# Altium project Archimajor.PrjPcb (part 1 of 3)
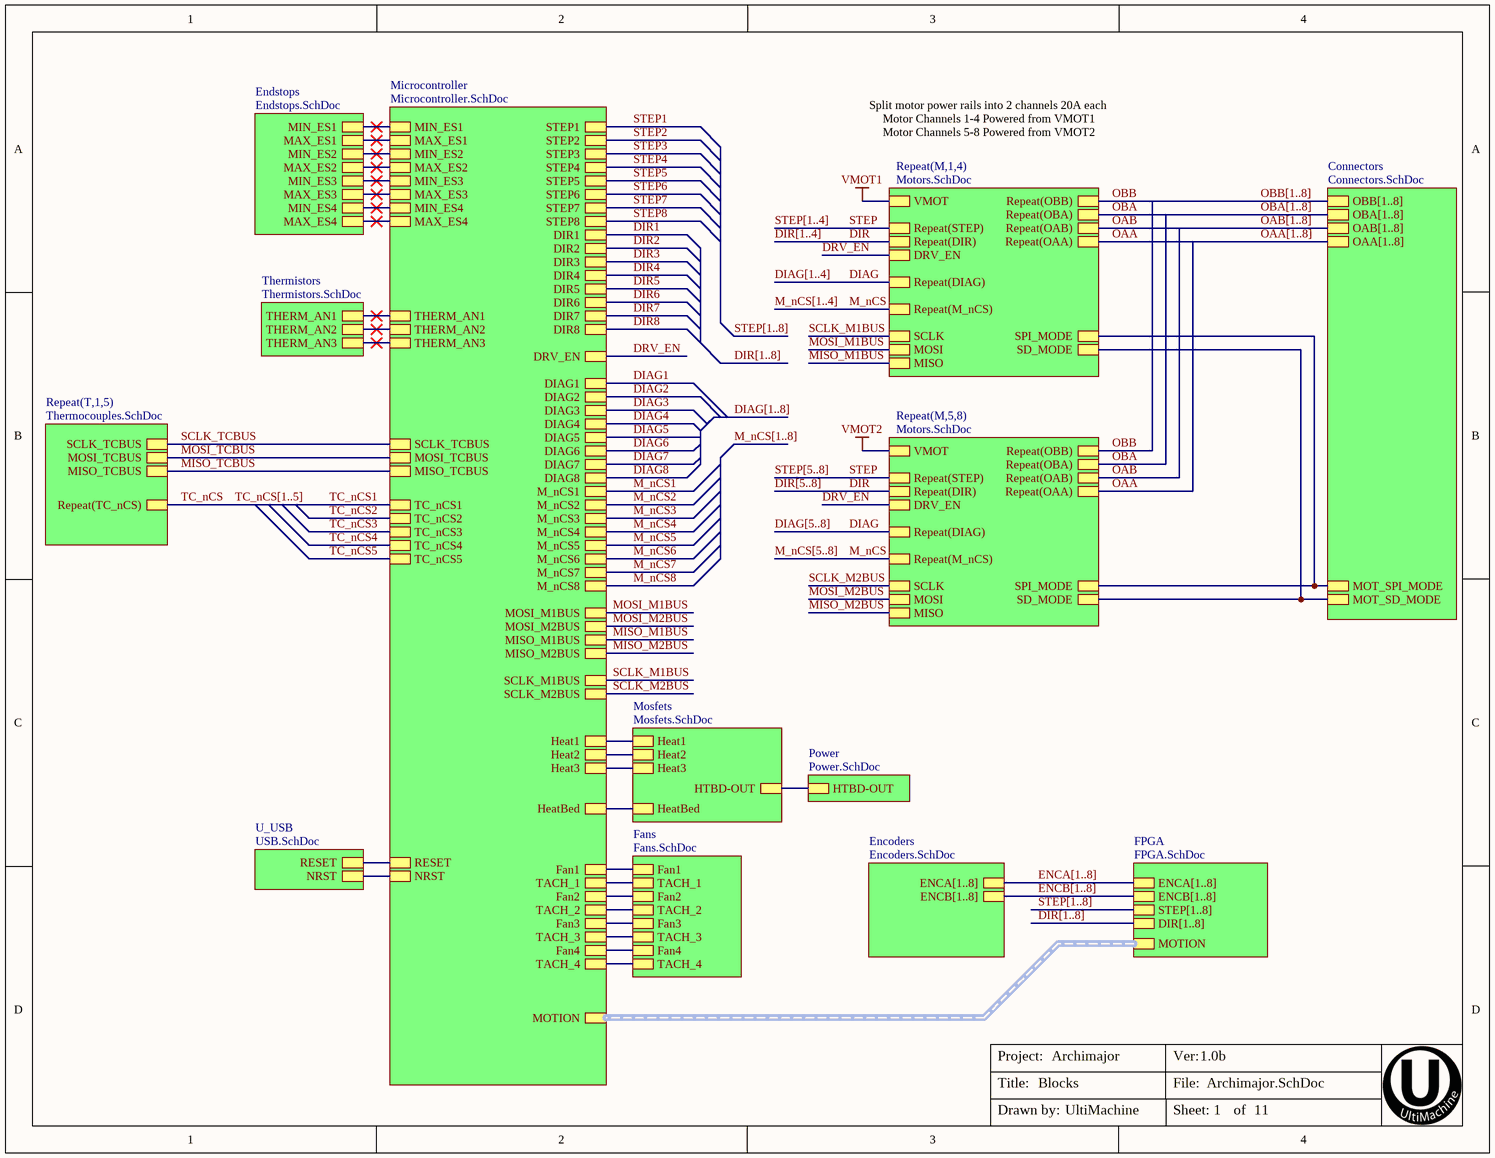
[diagram p0: Archimajor.SchDoc]
projectBoardVersion: 1.0b; projectDesigner: UltiMachine; projectdocumentNumber: .; projectDocumentRevision: b; projectTitle: Archimajor; projectVersion: 1.0b
9 sheets, 1081 parts. Net scope: hierarchical (ports join the sheet entries above them; power ports are global).
Board file: Archimajor.PcbDoc
Sheets:
  Archimajor.SchDoc
    M1 = Motors.SchDoc
    M2 = Motors.SchDoc
    M3 = Motors.SchDoc
    M4 = Motors.SchDoc
    Mosfets = Mosfets.SchDoc
    Power = Power.SchDoc
    Microcontroller = Microcontroller.SchDoc
    U_USB = USB.SchDoc
    M5 = Motors.SchDoc
    M6 = Motors.SchDoc
    M7 = Motors.SchDoc
    M8 = Motors.SchDoc
    T1 = Thermocouples.SchDoc
    T2 = Thermocouples.SchDoc
    T3 = Thermocouples.SchDoc
    T4 = Thermocouples.SchDoc
    T5 = Thermocouples.SchDoc
    Encoders = Encoders.SchDoc
    FPGA = FPGA.SchDoc

## Sheet Archimajor.SchDoc: Blocks
size Letter; DocumentNumber: 1; SheetNumber: 1; SheetTotal: 11

### Sub-sheets
Connectors = Connectors.SchDoc (file not in this document): MOT_SPI_MODE, MOT_SD_MODE, OBB[1..8], OBA[1..8], OAB[1..8], OAA[1..8]
Encoders = Encoders.SchDoc: ENCA[1..8], ENCB[1..8]
Endstops = Endstops.SchDoc (file not in this document): MAX_ES1, MIN_ES4, MAX_ES3, MAX_ES2, MIN_ES2, MIN_ES3, MIN_ES1, MAX_ES4
Fans = Fans.SchDoc (file not in this document): Fan3, TACH_3, TACH_2, Fan2, Fan4, Fan1, TACH_4, TACH_1
FPGA = FPGA.SchDoc: ENCA[1..8], ENCB[1..8], STEP[1..8], DIR[1..8], MOTION (harness MOTION)
Microcontroller = Microcontroller.SchDoc: TACH_4, THERM_AN1, THERM_AN2, THERM_AN3, TC_nCS1, MAX_ES1, MAX_ES3, MIN_ES2, MAX_ES2, MIN_ES1, MIN_ES3, HeatBed, Heat3, Heat2, Heat1, Fan2, Fan1, RESET, NRST, DRV_EN, TACH_3, TACH_1, TACH_2, TC_nCS2, DIAG1, DIR1, STEP1, M_nCS1, STEP2, M_nCS2, DIR2, DIR7, STEP3, M_nCS3, DIR3, STEP8, DIAG3, M_nCS4, STEP4, DIR4, DIAG4, M_nCS8, DIR5, STEP5, M_nCS5, DIAG5, DIR8, STEP7, DIAG6, STEP6, TC_nCS4, TC_nCS3, TC_nCS5, Fan3, Fan4, MIN_ES4, MAX_ES4, M_nCS6, DIAG7, M_nCS7, DIAG8, DIR6, MISO_M1BUS, MOSI_M1BUS, SCLK_TCBUS, SCLK_M1BUS, SCLK_M2BUS, MISO_TCBUS, MOSI_TCBUS, MOSI_M2BUS, MISO_M2BUS, DIAG2, MOTION (harness MOTION)
Mosfets = Mosfets.SchDoc: Heat2, Heat3, Heat1, HeatBed, HTBD-OUT
Power = Power.SchDoc: HTBD-OUT
Repeat(M,1,4) = Motors.SchDoc: Repeat(M_nCS), MOSI, MISO, SCLK, Repeat(STEP), Repeat(DIR), Repeat(DIAG), DRV_EN, SD_MODE, SPI_MODE, VMOT, Repeat(OBB), Repeat(OBA), Repeat(OAB), Repeat(OAA)
Repeat(M,5,8) = Motors.SchDoc: Repeat(M_nCS), MOSI, MISO, SCLK, Repeat(STEP), Repeat(DIR), Repeat(DIAG), DRV_EN, SD_MODE, SPI_MODE, VMOT, Repeat(OBB), Repeat(OBA), Repeat(OAB), Repeat(OAA)
Repeat(T,1,5) = Thermocouples.SchDoc: MISO_TCBUS, MOSI_TCBUS, SCLK_TCBUS, Repeat(TC_nCS)
Thermistors = Thermistors.SchDoc (file not in this document): THERM_AN3, THERM_AN1, THERM_AN2
U_USB = USB.SchDoc: NRST, RESET

### Nets
DIAG: sheet Repeat(M,1,4)/Repeat(DIAG), sheet Repeat(M,5,8)/Repeat(DIAG)
DIR: sheet Repeat(M,1,4)/Repeat(DIR), sheet Repeat(M,5,8)/Repeat(DIR)
DRV_EN: sheet Repeat(M,1,4)/DRV_EN, sheet Microcontroller/DRV_EN, sheet Repeat(M,5,8)/DRV_EN
Fan1: sheet Fans/Fan1, sheet Microcontroller/Fan1
Fan2: sheet Fans/Fan2, sheet Microcontroller/Fan2
Fan3: sheet Fans/Fan3, sheet Microcontroller/Fan3
Fan4: sheet Fans/Fan4, sheet Microcontroller/Fan4
Heat1: sheet Mosfets/Heat1, sheet Microcontroller/Heat1
Heat2: sheet Mosfets/Heat2, sheet Microcontroller/Heat2
Heat3: sheet Mosfets/Heat3, sheet Microcontroller/Heat3
HeatBed: sheet Mosfets/HeatBed, sheet Microcontroller/HeatBed
HTBD-OUT: sheet Mosfets/HTBD-OUT, sheet Power/HTBD-OUT
M_nCS: sheet Repeat(M,1,4)/Repeat(M_nCS), sheet Repeat(M,5,8)/Repeat(M_nCS)
MAX_ES1: sheet Endstops/MAX_ES1, sheet Microcontroller/MAX_ES1
MAX_ES2: sheet Endstops/MAX_ES2, sheet Microcontroller/MAX_ES2
MAX_ES3: sheet Endstops/MAX_ES3, sheet Microcontroller/MAX_ES3
MAX_ES4: sheet Endstops/MAX_ES4, sheet Microcontroller/MAX_ES4
MIN_ES1: sheet Endstops/MIN_ES1, sheet Microcontroller/MIN_ES1
MIN_ES2: sheet Endstops/MIN_ES2, sheet Microcontroller/MIN_ES2
MIN_ES3: sheet Endstops/MIN_ES3, sheet Microcontroller/MIN_ES3
MIN_ES4: sheet Endstops/MIN_ES4, sheet Microcontroller/MIN_ES4
MISO_M1BUS: sheet Repeat(M,1,4)/MISO, sheet Microcontroller/MISO_M1BUS
MISO_M2BUS: sheet Microcontroller/MISO_M2BUS, sheet Repeat(M,5,8)/MISO
MISO_TCBUS: sheet Microcontroller/MISO_TCBUS, sheet Repeat(T,1,5)/MISO_TCBUS
MOSI_M1BUS: sheet Repeat(M,1,4)/MOSI, sheet Microcontroller/MOSI_M1BUS
MOSI_M2BUS: sheet Microcontroller/MOSI_M2BUS, sheet Repeat(M,5,8)/MOSI
MOSI_TCBUS: sheet Microcontroller/MOSI_TCBUS, sheet Repeat(T,1,5)/MOSI_TCBUS
NRST: sheet Microcontroller/NRST, sheet U_USB/NRST
OAA: sheet Repeat(M,1,4)/Repeat(OAA), sheet Repeat(M,5,8)/Repeat(OAA)
OAB: sheet Repeat(M,1,4)/Repeat(OAB), sheet Repeat(M,5,8)/Repeat(OAB)
OBA: sheet Repeat(M,1,4)/Repeat(OBA), sheet Repeat(M,5,8)/Repeat(OBA)
OBB: sheet Repeat(M,1,4)/Repeat(OBB), sheet Repeat(M,5,8)/Repeat(OBB)
RESET: sheet Microcontroller/RESET, sheet U_USB/RESET
SCLK_M1BUS: sheet Repeat(M,1,4)/SCLK, sheet Microcontroller/SCLK_M1BUS
SCLK_M2BUS: sheet Microcontroller/SCLK_M2BUS, sheet Repeat(M,5,8)/SCLK
SCLK_TCBUS: sheet Microcontroller/SCLK_TCBUS, sheet Repeat(T,1,5)/SCLK_TCBUS
SD_MODE: sheet Repeat(M,1,4)/SD_MODE, sheet Connectors/MOT_SD_MODE, sheet Repeat(M,5,8)/SD_MODE
SPI_MODE: sheet Repeat(M,1,4)/SPI_MODE, sheet Connectors/MOT_SPI_MODE, sheet Repeat(M,5,8)/SPI_MODE
STEP: sheet Repeat(M,1,4)/Repeat(STEP), sheet Repeat(M,5,8)/Repeat(STEP)
TACH_1: sheet Fans/TACH_1, sheet Microcontroller/TACH_1
TACH_2: sheet Fans/TACH_2, sheet Microcontroller/TACH_2
TACH_3: sheet Fans/TACH_3, sheet Microcontroller/TACH_3
TACH_4: sheet Fans/TACH_4, sheet Microcontroller/TACH_4
TC_nCS: sheet Repeat(T,1,5)/Repeat(TC_nCS)
THERM_AN1: sheet Thermistors/THERM_AN1, sheet Microcontroller/THERM_AN1
THERM_AN2: sheet Thermistors/THERM_AN2, sheet Microcontroller/THERM_AN2
THERM_AN3: sheet Thermistors/THERM_AN3, sheet Microcontroller/THERM_AN3

### Buses and harness runs
bus DIAG[1..4]
bus DIAG[1..8]
bus DIAG[5..8]
bus DIR[1..4]
bus DIR[1..8]
bus DIR[1..8] = sheet FPGA/DIR[1..8]
bus DIR[5..8]
bus ENCA[1..8] = sheet Encoders/ENCA[1..8] = sheet FPGA/ENCA[1..8]
bus ENCB[1..8] = sheet Encoders/ENCB[1..8] = sheet FPGA/ENCB[1..8]
bus M_nCS[1..4]
bus M_nCS[1..8]
bus M_nCS[5..8]
bus OAA[1..8] = sheet Connectors/OAA[1..8]
bus OAB[1..8] = sheet Connectors/OAB[1..8]
bus OBA[1..8] = sheet Connectors/OBA[1..8]
bus OBB[1..8] = sheet Connectors/OBB[1..8]
bus STEP[1..4]
bus STEP[1..8]
bus STEP[1..8] = sheet FPGA/STEP[1..8]
bus STEP[5..8]
bus TC_nCS[1..5]
harness sheet FPGA/MOTION = sheet Microcontroller/MOTION

### Notes on the sheet
- Split motor power rails into 2 channels 20A each
- Motor Channels 1-4 Powered from VMOT1
- Motor Channels 5-8 Powered from VMOT2
- Title:
- Project:
- File:
- Ver:
- Drawn by:
- Sheet:
- of

## Sheet Motors.SchDoc: Motors
size Letter; DocumentNumber: 5; SheetNumber: 5; SheetTotal: 11
Used 8 times, as channels M1, M2, M3, M4, M5, M6, M7, M8. Parts and nets are listed once, with the designators drawn on the sheet.
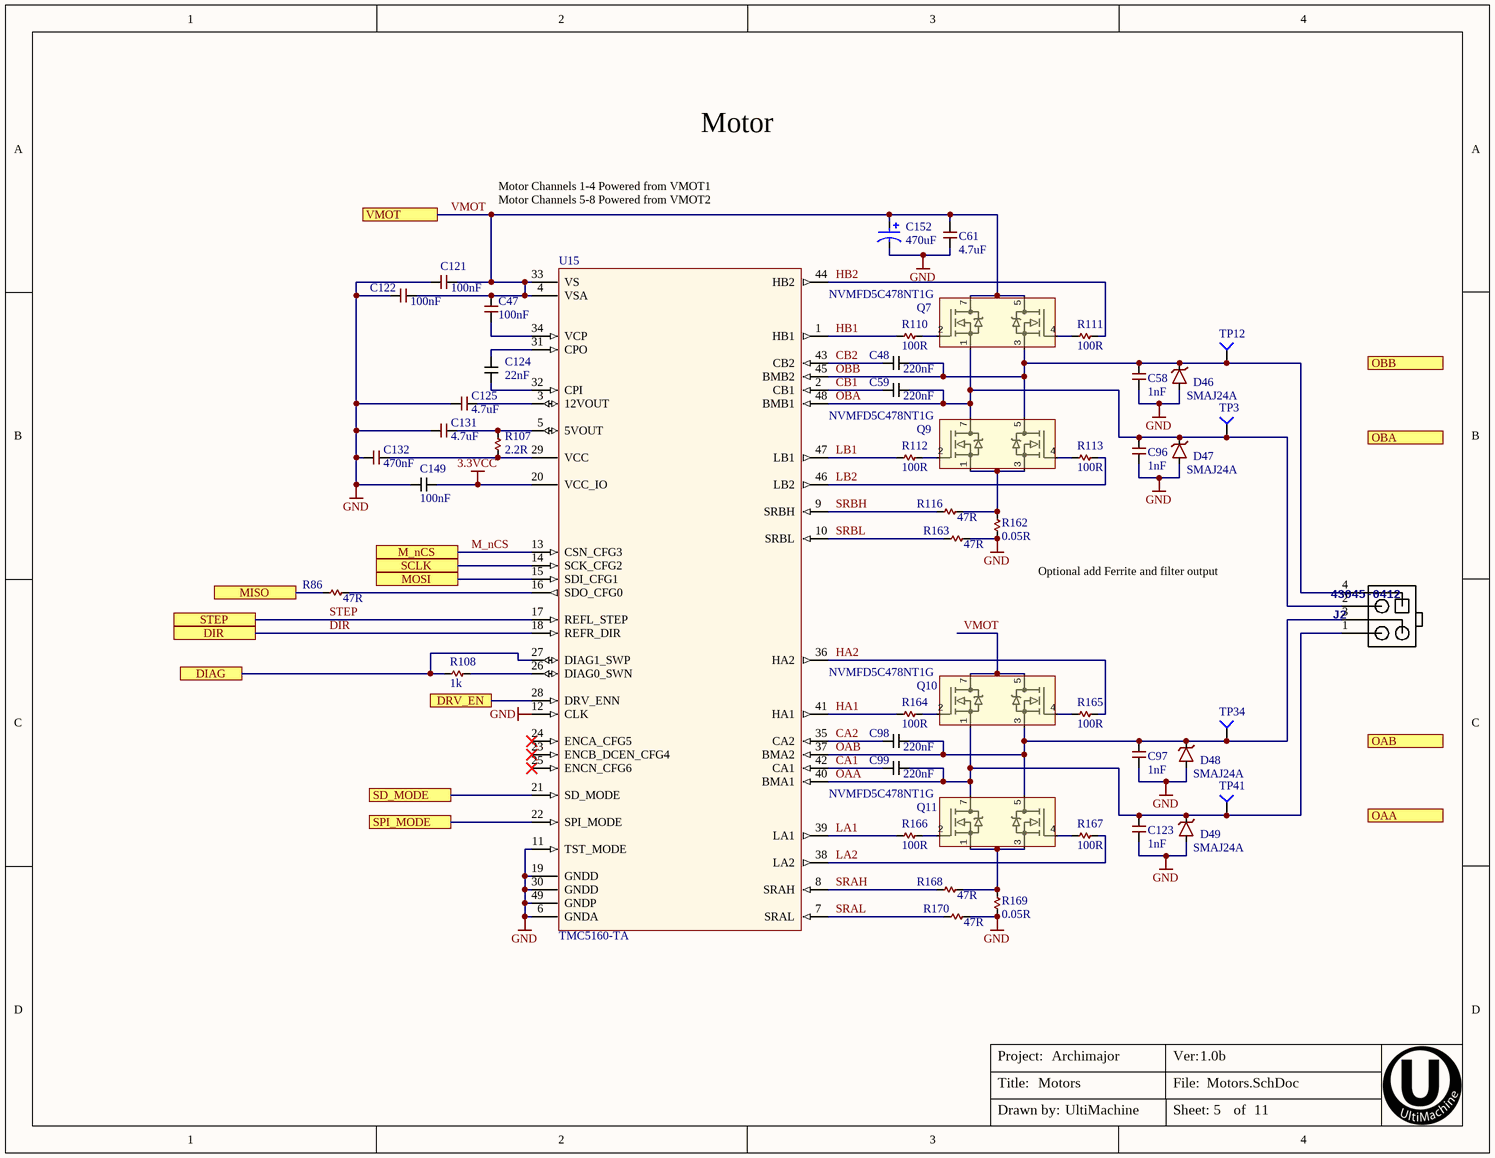
[diagram p1: Motors.SchDoc]

### Parts
C47  100nF  [C0603]
C48  220nF  [C0603]
C58  1nF  [C0603]
C59  220nF  [C0603]
C61  4.7uF  [C1206]
C96  1nF  [C0603]
C97  1nF  [C0603]
C98  220nF  [C0603]
C99  220nF  [C0603]
C121  100nF  [C0603]
C122  100nF  [C0603]
C123  1nF  [C0603]
C124  22nF  [C0603]
C125  4.7uF  [C1206]
C131  value 4.7uF  [C0603]  (hidden comment: 4.7uF 6.3V 0603)
C132  value 470nF  [C0402]  (hidden comment: 0402)
C149  100nF  [C0201 Large Pads]
C152  470uF  [CAP16x17]
D46  SMAJ24A  [SMA-SM]
D47  SMAJ24A  [SMA-SM]
D48  SMAJ24A  [SMA-SM]
D49  SMAJ24A  [SMA-SM]
J2  43045-0412  [43045-0412]
Q7  NVMFD5C478NT1G  [SO8FL-Dual (DFN8 5x6, 1.26P Dual Flag)]
Q9  NVMFD5C478NT1G  [SO8FL-Dual (DFN8 5x6, 1.26P Dual Flag)]
Q10  NVMFD5C478NT1G  [SO8FL-Dual (DFN8 5x6, 1.26P Dual Flag)]
Q11  NVMFD5C478NT1G  [SO8FL-Dual (DFN8 5x6, 1.26P Dual Flag)]
R86  47R  [R0402]
R107  2.2R  [R0402]
R108  1k  [R0402]
R110  100R  [R0402]
R111  100R  [R0402]
R112  100R  [R0402]
R113  100R  [R0402]
R116  47R  [R0402]
R162  0.05R  [R2512]
R163  47R  [R0402]
R164  100R  [R0402]
R165  100R  [R0402]
R166  100R  [R0402]
R167  100R  [R0402]
R168  47R  [R0402]
R169  0.05R  [R2512]
R170  47R  [R0402]
TP3  TP4  [TP-2]  (value not drawn)  (no BOM)
TP12  TP4  [TP-2]  (value not drawn)  (no BOM)
TP34  TP4  [TP-2]  (value not drawn)  (no BOM)
TP41  TP4  [TP-2]  (value not drawn)  (no BOM)
U15  TMC5160-TA  [TQFP48-EP]

### Ports
DIAG, DIR, DRV_EN, M_nCS, MISO, MOSI, OAA, OAB, OBA, OBB, SCLK, SD_MODE, SPI_MODE, STEP, VMOT

### Nets
3.3VCC: C149.2 U15.20(VCC_IO)
GND: C58.1 C61.1 C96.1 C97.1 C121.1 C122.1 C123.1 C125.1 C131.1 C132.1 C149.1 C152.2 D46.A D47.A D48.A D49.A R162.2 R163.2 R169.1 R170.2 U15.6(GNDA) U15.11(TST_MODE) U15.12(CLK) U15.19(GNDD) U15.30(GNDD) U15.49(GNDP)
CA1: C99.1 U15.42(CA1)
CA2: C98.1 U15.35(CA2)
CB1: C59.1 U15.2(CB1)
CB2: C48.1 U15.43(CB2)
DIAG: R108.2 U15.27(DIAG1_SWP) ; port DIAG
DIR: U15.18(REFR_DIR) ; port DIR
DRV_EN: U15.28(DRV_ENN) ; port DRV_EN
HA1: R164.1 U15.41(HA1)
HA2: R165.2 U15.36(HA2)
HB1: R110.1 U15.1(HB1)
HB2: R111.2 U15.44(HB2)
LA1: R166.1 U15.39(LA1)
LA2: R167.2 U15.38(LA2)
LB1: R112.1 U15.47(LB1)
LB2: R113.2 U15.46(LB2)
M_nCS: U15.13(CSN_CFG3) ; port M_nCS
MISO: R86.1 ; port MISO
MOSI: U15.15(SDI_CFG1) ; port MOSI
OAA: C99.2 C123.2 D49.K J2.1 Q10.1(S2) Q11.7(D2) TP41.1 U15.40(BMA1)
OAB: C97.2 C98.2 D48.K J2.3 Q10.3(S1) Q11.5(D1) TP34.1 U15.37(BMA2)
OBA: C59.2 C96.2 D47.K J2.2 Q7.1(S2) Q9.7(D2) TP3.1 U15.48(BMB1)
OBB: C48.2 C58.2 D46.K J2.4 Q7.3(S1) Q9.5(D1) TP12.1 U15.45(BMB2)
SCLK: U15.14(SCK_CFG2) ; port SCLK
SD_MODE: U15.21(SD_MODE) ; port SD_MODE
SPI_MODE: U15.22(SPI_MODE) ; port SPI_MODE
SRAH: R168.1 U15.8(SRAH)
SRAL: R170.1 U15.7(SRAL)
SRBH: R116.1 U15.9(SRBH)
SRBL: R163.1 U15.10(SRBL)
STEP: U15.17(REFL_STEP) ; port STEP
VMOT: C47.2 C61.2 C121.2 C122.2 C152.1 Q7.5(D1) Q7.7(D2) Q10.5(D1) Q10.7(D2) U15.4(VSA) U15.33(VS) ; port VMOT
NetC47_1: C47.1 U15.34(VCP)
NetC124_1: C124.1 U15.32(CPI)
NetC124_2: C124.2 U15.31(CPO)
NetC125_2: C125.2 U15.3(12VOUT)
NetC131_2: C131.2 R107.2 U15.5(5VOUT)
NetC132_2: C132.2 R107.1 U15.29(VCC)
NetQ7_2: Q7.2(G2) R110.2
NetQ7_4: Q7.4(G1) R111.1
NetQ9_1: Q9.1(S2) Q9.3(S1) R116.2 R162.1
NetQ9_2: Q9.2(G2) R112.2
NetQ9_4: Q9.4(G1) R113.1
NetQ10_2: Q10.2(G2) R164.2
NetQ10_4: Q10.4(G1) R165.1
NetQ11_1: Q11.1(S2) Q11.3(S1) R168.2 R169.2
NetQ11_2: Q11.2(G2) R166.2
NetQ11_4: Q11.4(G1) R167.1
NetR86_2: R86.2 U15.16(SDO_CFG0)
NetR108_1: R108.1 U15.26(DIAG0_SWN)

Not connected (* = marked no-connect by the designer): U15 23(ENCB_DCEN_CFG4)* 24(ENCA_CFG5)* 25(ENCN_CFG6)*

### Channels
M1: designators end in A; ports DIAG=DIAG1 DIR=DIR DRV_EN=DRV_EN M_nCS=M_nCS MISO=MISO_M1BUS MOSI=MOSI_M1BUS OAA=OAA1 OAB=OAB1 OBA=OBA1 OBB=OBB1 SCLK=SCLK_M1BUS SD_MODE=SD_MODE SPI_MODE=SPI_MODE STEP=STEP VMOT=VMOT
M2: designators end in B; ports DIAG=DIAG2 DIR=DIR DRV_EN=DRV_EN M_nCS=M_nCS MISO=MISO_M1BUS MOSI=MOSI_M1BUS OAA=OAA2 OAB=OAB2 OBA=OBA2 OBB=OBB2 SCLK=SCLK_M1BUS SD_MODE=SD_MODE SPI_MODE=SPI_MODE STEP=STEP VMOT=VMOT
M3: designators end in C; ports DIAG=DIAG3 DIR=DIR DRV_EN=DRV_EN M_nCS=M_nCS MISO=MISO_M1BUS MOSI=MOSI_M1BUS OAA=OAA3 OAB=OAB3 OBA=OBA3 OBB=OBB3 SCLK=SCLK_M1BUS SD_MODE=SD_MODE SPI_MODE=SPI_MODE STEP=STEP VMOT=VMOT
M4: designators end in D; ports DIAG=DIAG4 DIR=DIR DRV_EN=DRV_EN M_nCS=M_nCS MISO=MISO_M1BUS MOSI=MOSI_M1BUS OAA=OAA4 OAB=OAB4 OBA=OBA4 OBB=OBB4 SCLK=SCLK_M1BUS SD_MODE=SD_MODE SPI_MODE=SPI_MODE STEP=STEP VMOT=VMOT
M5: designators end in E; ports DIAG=DIAG5 DIR=DIR DRV_EN=DRV_EN M_nCS=M_nCS MISO=MISO_M2BUS MOSI=MOSI_M2BUS OAA=OAA5 OAB=OAB5 OBA=OBA5 OBB=OBB5 SCLK=SCLK_M2BUS SD_MODE=SD_MODE SPI_MODE=SPI_MODE STEP=STEP VMOT=VMOT
M6: designators end in F; ports DIAG=DIAG6 DIR=DIR DRV_EN=DRV_EN M_nCS=M_nCS MISO=MISO_M2BUS MOSI=MOSI_M2BUS OAA=OAA6 OAB=OAB6 OBA=OBA6 OBB=OBB6 SCLK=SCLK_M2BUS SD_MODE=SD_MODE SPI_MODE=SPI_MODE STEP=STEP VMOT=VMOT
M7: designators end in G; ports DIAG=DIAG7 DIR=DIR DRV_EN=DRV_EN M_nCS=M_nCS MISO=MISO_M2BUS MOSI=MOSI_M2BUS OAA=OAA7 OAB=OAB7 OBA=OBA7 OBB=OBB7 SCLK=SCLK_M2BUS SD_MODE=SD_MODE SPI_MODE=SPI_MODE STEP=STEP VMOT=VMOT
M8: designators end in H; ports DIAG=DIAG8 DIR=DIR DRV_EN=DRV_EN M_nCS=M_nCS MISO=MISO_M2BUS MOSI=MOSI_M2BUS OAA=OAA8 OAB=OAB8 OBA=OBA8 OBB=OBB8 SCLK=SCLK_M2BUS SD_MODE=SD_MODE SPI_MODE=SPI_MODE STEP=STEP VMOT=VMOT

### Notes on the sheet
- Motor
- Motor Channels 1-4 Powered from VMOT1
- Motor Channels 5-8 Powered from VMOT2
- Optional add Ferrite and filter output
- Title:
- Project:
- File:
- Ver:
- Drawn by:
- Sheet:
- of

### Library data of the parts
C47 C121 C122 = 100nF 0603 50V X7R: CAP CER 0603 100nF 50V 10% X7R; MANUFACTURER: Kemet; MANUFACTURER #: C0603C104K5RACTU; PART DESCRIPTION: 0.10µF ±10% 50V Ceramic Capacitor X7R 0603 (1608 Metric); DISTRIBUTOR #: 399-5089-2-ND; DISTRIBUTOR: Digikey; PART: C0603C104K5RACTU; TOLERANCE: 10%; EE_SPEC: 50V; VALUE: 100nF
C48 C59 C98 C99 = 220nF 50V X7R 0603: CAP CER 0.22UF 50V X7R 0603; MANUFACTURER: TDK; MANUFACTURER #: CGA3E3X7R1H224K080AB; PART DESCRIPTION: 0.22µF ±10% 50V Ceramic Capacitor X7R 0603 (1608 Metric); EE_SPEC: 50V X7R; VALUE: 220nF; PART: CGA3E3X7R1H224K080AB
C58 C96 C97 C123 = 1nF 50V X7R 0603: CAP CER 0603  1nF 50v 10% X7R; Manufacturer: Kemet; MANUFACTURER #: C0603C102K5RACTU; Part Description: 1000pF ±10% 50V Ceramic Capacitor X7R 0603 (1608 Metric); Tolerance: +/- 10%; VALUE: 1nF; DISTRIBUTOR #: 399-1082-2-ND; DISTRIBUTOR: Digi-Key; EE_SPEC: 1nF 50V X7R 0603; PART: C0603C102K5RACTU
C61 C125 = 4.7uF 1206 50V X5R: CAP CER 1206 4.7uF 50V 10% X5R; MANUFACTURER: Kemet; MANUFACTURER #: C1206C475K5PACTU; PART DESCRIPTION: 4.7µF ±10% 50V Ceramic Capacitor X5R 1206 (3216 Metric); DISTRIBUTOR #: 399-5507-2-ND; DISTRIBUTOR: Digikey; PART: C1206C475K5PACTU; TOLERANCE: 10%; EE_SPEC: 50V; VALUE: 4.7uF
C124 = 22nF 100V X7R 0603: CAP CER 0.022UF 100V X7R 0603; MANUFACTURER: Kemet; MANUFACTURER #: C0603C223K1RACTU; PART DESCRIPTION: 0.022µF ±10% 100V Ceramic Capacitor X7R 0603 (1608 Metric); EE_SPEC: 100 X7R; VALUE: 22nF; PART: C0603C223K1RACTU
C131 = 4.7uF 0603 6.3V X7R: CAP CER 4.7UF 6.3V X7R 0603; MANUFACTURER: Samsung; MANUFACTURER #: CL10B475KQ8NQNC; PART DESCRIPTION: 4.7µF ±10% 6.3V Ceramic Capacitor X7R 0603 (1608 Metric); TOLERANCE: 10%; DISTRIBUTOR #: 1276-2087-2-ND; DISTRIBUTOR: Digikey; PART: CL10B475KQ8NQNC; EE_SPEC: 6.3V
C132 = 470nF 0402 6.3V X5R: 470nF 6.3v C0402 - GRM155R60J474KE19D; PART DESCRIPTION: 470nF ±10% 6.3V Ceramic Capacitor X5R 0402 (1005 Metric); MANUFACTURER: Murata; TOLERANCE: 10%; EE_SPEC: 6.3V; MANUFACTURER #: GRM155R60J474KE19D; DISTRIBUTOR #: 490-3266-2-ND; DISTRIBUTOR: Digikey; PART: GRM155R60J474KE19D
C149 = 100nF 6.3V X5R 0201: CAP CER 0.1UF 6.3V 10% X5R 0201; MANUFACTURER: Samsung; MANUFACTURER #: CL03A104KQ3NNNC; VALUE: 100nF; DISTRIBUTOR: DIGI-KEY; DISTRIBUTOR #: 1276-1013-1-ND; TOLERANCE: 10%; VOLTAGE: 6.3V; PART: CL03A104KQ3NNNC
C152 = 470uF Al-El 50V 80mOhms 16-18mmD: CAP ALUM 470UF 20% 50V SMD; MANUFACTURER #: UCZ1H471MNQ1MS; MANUFACTURER: Nichicon; PART DESCRIPTION: 470µF 50V Aluminum Electrolytic Capacitors Radial, Can - SMD 80 mOhm @ 100kHz 3500 Hrs @ 125°C; EE_SPEC: 80 mOhms, 2A @ 100Khz; PART: UCZ1H471MNQ1MS; TOLERANCE: 20%; VALUE: 470uF
D46-D49 = SMAJ24A: TVS DIODE 24V 38.9V SMA; Manufacturer: Bourns Inc; EE_SPEC: 24Vrs 38.9Vc; MANUFACTURER #: SMAJ24A; DISTRIBUTOR #: SMAJ24ABTR-ND; DISTRIBUTOR: Digi-Key; Part Description: TVS DIODE 24V 38.9V SMA; VALUE: SMAJ24A; PART: SMAJ24A
J2 = Micro-Fit THT 4pos 3mm: Conn - 3mm Pitch Fixed; MANUFACTURER: Molex; EE_SPEC: 600V 8A 3mm; Value: 43045-0412; MANUFACTURER #: 43045-0412; PART: 43045-0412; Part Description: Micro-Fit THT 4pos 3mm
Q7 Q9-Q11 = NVMFD5C478NT1G: 40V 17 MOHM T6 S08FL DUAL; MANUFACTURER: ON Semiconductor; PART DESCRIPTION: Mosfet Array 2 N-Channel (Dual) 40V 9.8A (Ta), 27A (Tc) 3.1W (Ta), 23W (Tc) Surface Mount 8-DFN (5x6) Dual Flag (SO8FL-Dual); TOLERANCE: -NA-; MANUFACTURER #: NVMFD5C478NT1G; DISTRIBUTOR #: NVMFD5C478NT1GOSCT-ND; DISTRIBUTOR: Digikey; VALUE: NVMFD5C478NT1G; EE_SPEC: 40V 17 MOHM; PART: NVMFD5C478NT1G
R86 R116 R163 R168 R170 = 47R 1% 0402: RES 47 OHM 1% 1/16W 0402; MANUFACTURER: Vishay Dale; MANUFACTURER #: CRCW040247R0FKEDC; Part Description: 47 Ohms ±1% 0.063W, 1/16W Chip Resistor 0402 (1005 Metric)  Thick Film; Tolerance: +/- 1%; VALUE: 47R; EE_SPEC: 47R 1% 0402; PART: CRCW040247R0FKEDC
R107 = 2.2R 5% 0402: RES SMD 2.2 OHM 5% 1/16W 0402; MANUFACTURER: Yageo; MANUFACTURER #: RC0402JR-072R2L; Part Description: 2.2 Ohms ±5% 0.063W, 1/16W Chip Resistor 0402 (1005 Metric) Moisture Resistant Thick Film; Tolerance: +/- 5%; VALUE: 2.2R; EE_SPEC: 2.2R 5% 0402; PART: RC0402JR-072R2L
R108 = 1k 1% 0402: RES 0402 1k 63mW 1%; MANUFACTURER: Yageo; MANUFACTURER #: RC0402FR-071KL; PART DESCRIPTION: 1k Ohm ±1% 0.063W, 1/16W Chip Resistor 0402 (1005 Metric) Moisture Resistant Thick Film; EE_SPEC: 1/16W; VALUE: 1k; DISTRIBUTOR #: 311-1.00KLRTR-ND; DISTRIBUTOR: Digikey; PART: RC0402FR-071KL; TOLERANCE: 1%
R110-R113 R164-R167 = 100R 1% 0402: RES SMD 100 OHM 1% 1/16W 0402; MANUFACTURER: Yageo; MANUFACTURER #: RC0402FR-07100RL; PART DESCRIPTION: 100 Ohm ±1% 0.063W, 1/16W Chip Resistor 0402 (1005 Metric) Moisture Resistant Thick Film; DISTRIBUTOR #: 311-100LRTR-ND; DISTRIBUTOR: Digikey; PART: 100R 1% 0402; TOLERANCE: 1%; EE_SPEC: 1/16W; VALUE: 100R
R162 = 0.1R 1% 1206: RES 0.05 OHM 1% 2W 2512; MANUFACTURER: Stackpole; MANUFACTURER #: CSRN2512FK50L0; Part Description: 50 mOhms ±1% 2W Chip Resistor 2512 (6432 Metric) Current Sense Thick Film; Tolerance: +/- 1%; VALUE: 0.05R; EE_SPEC: 0.05R 1% 2512; PART: CSRN2512FK50L0
R169 = 0.05R 1% 2512: RES 0.05 OHM 1% 2W 2512; MANUFACTURER: Stackpole; MANUFACTURER #: CSRN2512FK50L0; Part Description: 50 mOhms ±1% 2W Chip Resistor 2512 (6432 Metric) Current Sense Thick Film; Tolerance: +/- 1%; VALUE: 0.05R; EE_SPEC: 0.05R 1% 2512; PART: CSRN2512FK50L0
TP3 TP12 TP34 TP41 = Socket: MANUFACTURER #: NOTAPART-Testpoint; PART: NOTAPART-Testpoint
U15 = TMC5160-TA: IC STEPPER MOTOR DVR TQFP48-EP; MANUFACTURER: Trinamic; EE_SPEC: 60V 1/256 Step; VALUE: TMC5160-TA; MANUFACTURER #: TMC5160-TA; Part Description: IC STEPPER MOTOR DVR TQFP48-EP

## Sheet Mosfets.SchDoc: Mosfets
size Letter; DocumentNumber: 9; SheetNumber: 9; SheetTotal: 11
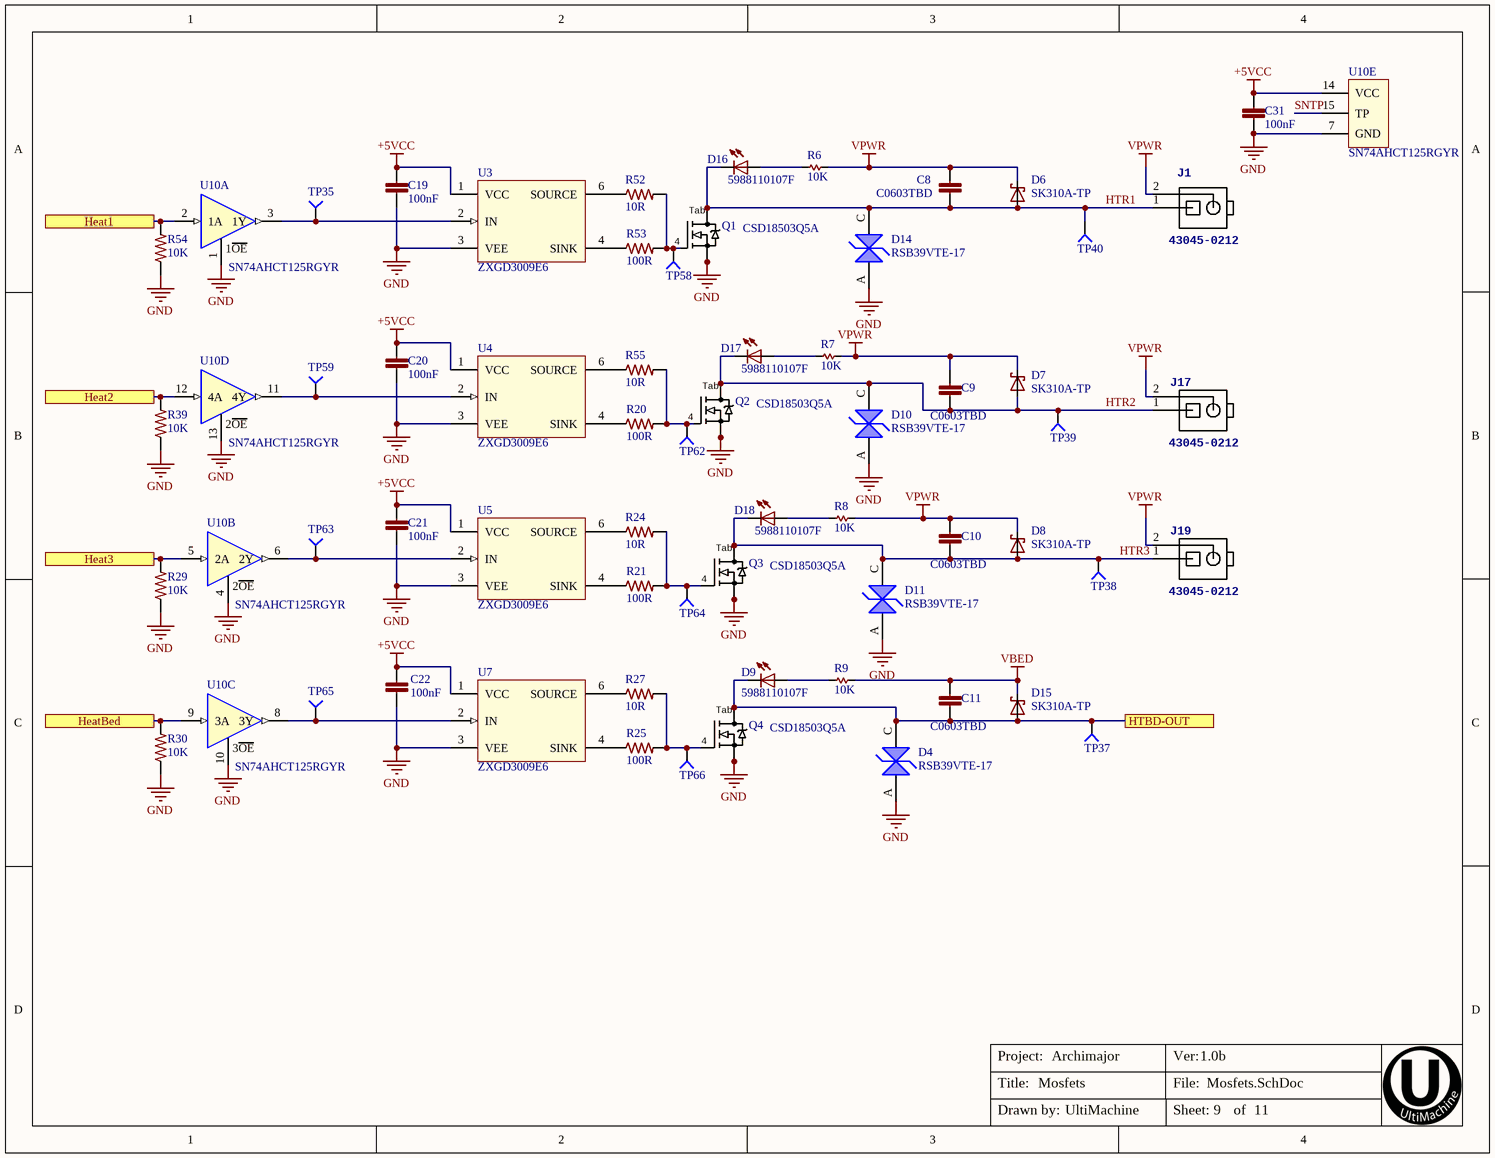
[diagram p2: Mosfets.SchDoc]

### Parts
C8  C0603TBD  [C0603]
C9  C0603TBD  [C0603]
C10  C0603TBD  [C0603]
C11  C0603TBD  [C0603]
C19  100nF  [C0402]
C20  100nF  [C0402]
C21  100nF  [C0402]
C22  100nF  [C0402]
C31  100nF  [C0402]
D4  RSB39VTE-17  [SOD323-R]
D6  SK310A-TP  [SMA-SM]
D7  SK310A-TP  [SMA-SM]
D8  SK310A-TP  [SMA-SM]
D9  Red  [LED2012120]  (value not drawn)
D10  RSB39VTE-17  [SOD323-R]
D11  RSB39VTE-17  [SOD323-R]
D14  RSB39VTE-17  [SOD323-R]
D15  SK310A-TP  [SMA-SM]
D16  Red  [LED2012120]  (value not drawn)
D17  Red  [LED2012120]  (value not drawn)
D18  Red  [LED2012120]  (value not drawn)
J1  43045-0212  [43045-0212]
J17  43045-0212  [43045-0212]
J19  43045-0212  [43045-0212]
Q1  CSD18503Q5A  [SOT669_Universal]
Q2  CSD18503Q5A  [SOT669_Universal]
Q3  CSD18503Q5A  [SOT669_Universal]
Q4  CSD18503Q5A  [SOT669_Universal]
R6  10K  [R0402]
R7  10K  [R0402]
R8  10K  [R0402]
R9  10K  [R0402]
R20  100R  [R0402]
R21  100R  [R0402]
R24  10R  [R0402]
R25  100R  [R0402]
R27  10R  [R0402]
R29  10K  [R0402]
R30  10K  [R0402]
R39  10K  [R0402]
R52  10R  [R0402]
R53  100R  [R0402]
R54  10K  [R0402]
R55  10R  [R0402]
TP35  TP4  [TP-2]  (value not drawn)  (no BOM)
TP37  TP4  [TP-2]  (value not drawn)  (no BOM)
TP38  TP4  [TP-2]  (value not drawn)  (no BOM)
TP39  TP4  [TP-2]  (value not drawn)  (no BOM)
TP40  TP4  [TP-2]  (value not drawn)  (no BOM)
TP58  TP4  [TP-2]  (value not drawn)  (no BOM)
TP59  TP4  [TP-2]  (value not drawn)  (no BOM)
TP62  TP4  [TP-2]  (value not drawn)  (no BOM)
TP63  TP4  [TP-2]  (value not drawn)  (no BOM)
TP64  TP4  [TP-2]  (value not drawn)  (no BOM)
TP65  TP4  [TP-2]  (value not drawn)  (no BOM)
TP66  TP4  [TP-2]  (value not drawn)  (no BOM)
U3  ZXGD3009E6  [SOT26P285X140-6L]
U4  ZXGD3009E6  [SOT26P285X140-6L]
U5  ZXGD3009E6  [SOT26P285X140-6L]
U7  ZXGD3009E6  [SOT26P285X140-6L]
U10  SN74AHCT125RGYR  [QFN50P350X350X100_RGY_S-PVQFN-N14]  (parts A,B,C,D,E of 5)

### Ports
Heat1, Heat2, Heat3, HeatBed, HTBD-OUT

### Nets
+5VCC: C19.2 C20.2 C21.2 C22.1 C31.2 U3.1(VCC) U4.1(VCC) U5.1(VCC) U7.1(VCC) U10.14(VCC)
GND: C19.1 C20.1 C21.1 C22.2 C31.1 D4.A D10.A D11.A D14.A Q1.1(S) Q1.2(S) Q1.3(S) Q2.1(S) Q2.2(S) Q2.3(S) Q3.1(S) Q3.2(S) Q3.3(S) Q4.1(S) Q4.2(S) Q4.3(S) R29.1 R30.1 R39.1 R54.1 U3.3(VEE) U4.3(VEE) U5.3(VEE) U7.3(VEE) U10.1(1OE) U10.4(2OE) U10.7(GND) U10.10(3OE) U10.13(4OE)
VBED: C11.1 D15.C R9.2
VPWR: C8.1 C9.1 C10.1 D6.C D7.C D8.C J1.2 J17.2 J19.2 R6.2 R7.2 R8.2
Heat1: R54.2 U10.2(1A) ; port Heat1
Heat2: R39.2 U10.12(4A) ; port Heat2
Heat3: R29.2 U10.5(2A) ; port Heat3
HeatBed: R30.2 U10.9(3A) ; port HeatBed
HTBD-OUT: C11.2 D4.C D9.C D15.A Q4.TAB(D) TP37.1 ; port HTBD-OUT
HTR1: C8.2 D6.A D14.C D16.C J1.1 Q1.TAB(D) TP40.1
HTR2: C9.2 D7.A D10.C D17.C J17.1 Q2.TAB(D) TP39.1
HTR3: C10.2 D8.A D11.C D18.C J19.1 Q3.TAB(D) TP38.1
SNTP: U10.15(TP)
NetD9_A: D9.A R9.1
NetD16_A: D16.A R6.1
NetD17_A: D17.A R7.1
NetD18_A: D18.A R8.1
NetQ1_4: Q1.4(G) R52.2 R53.2 TP58.1
NetQ2_4: Q2.4(G) R20.2 R55.2 TP62.1
NetQ3_4: Q3.4(G) R21.2 R24.2 TP64.1
NetQ4_4: Q4.4(G) R25.2 R27.2 TP66.1
NetR20_1: R20.1 U4.4(SINK)
NetR21_1: R21.1 U5.4(SINK)
NetR24_1: R24.1 U5.6(SOURCE)
NetR25_1: R25.1 U7.4(SINK)
NetR27_1: R27.1 U7.6(SOURCE)
NetR52_1: R52.1 U3.6(SOURCE)
NetR53_1: R53.1 U3.4(SINK)
NetR55_1: R55.1 U4.6(SOURCE)
NetTP35_1: TP35.1 U3.2(IN) U10.3(1Y)
NetTP59_1: TP59.1 U4.2(IN) U10.11(4Y)
NetTP63_1: TP63.1 U5.2(IN) U10.6(2Y)
NetTP65_1: TP65.1 U7.2(IN) U10.8(3Y)

### Notes on the sheet
- Title:
- Project:
- File:
- Ver:
- Drawn by:
- Sheet:
- of
- (in symbol CSD18503Q5A) Tab

### Library data of the parts
C8-C11 = C0603TBD: Capacitor Non Polarized; MANUFACTURER #: DNI-C0603TBD; VALUE: C0603TBD; PART: DNI-C0603TBD; DNI: DNI
C19-C22 C31 = GRM155R71C104KA88D: CAP CER 0402 100nF 16V 10% X7R; MANUFACTURER: Murata; PART DESCRIPTION: 0.10µF ±10% 16V Ceramic Capacitor X7R 0402 (1005 Metric); EE_SPEC: 100nF 16V X7R 0402; VALUE: 100nF; MANUFACTURER #: GRM155R71C104KA88D; DISTRIBUTOR #: 490-3261-2-ND; DISTRIBUTOR: Digi-Key Electronics; PART: GRM155R71C104KA88D; TOLERANCE: 10%
D4 D10 D11 D14 = RSB39VTE-17: DIODE TVS; MANUFACTURER: Rohm; PART DESCRIPTION: TVS DIODE 30VWM SOD323; TOLERANCE: -NA-; VALUE: 30V; EE_SPEC: 30Vso 30pF; MANUFACTURER #: RSB39VTE-17; DISTRIBUTOR #: RSB39VTE-17TR-ND; DISTRIBUTOR: Digi-Key Electronics; PART: RSB39VTE-17
D6-D8 D15 = SK310A: DIODE Schottky 3A SMA; MANUFACTURER: MCC; PART DESCRIPTION: Diode Schottky 100V 3A Surface Mount DO-214AC (HSMA); TOLERANCE: -NA-; VALUE: -NA-; EE_SPEC: 100V 3A; MANUFACTURER #: SK310A; DISTRIBUTOR #: SK310A-TPTR-ND; DISTRIBUTOR: Digi-Key Electronics; PART: SK310A
D9 D16-D18 = 5988110107F: LED 0805 Red; MANUFACTURER: Dialight; PART DESCRIPTION: Red 635nm LED Indication - Discrete 2.2V 0805 (2012 Metric); TOLERANCE: -NA-; EE_SPEC: Vf=2.2V; VALUE: Red; PART: 5988110107F; MANUFACTURER #: 5988110107F; DISTRIBUTOR #: 350-2038-2-ND; DISTRIBUTOR: Digi-Key Electronics
J1 J17 J19 = Micro-Fit THT 2pos 3mm: Conn - 3mm Pitch Fixed; MANUFACTURER: Molex; EE_SPEC: 600V 8A 3mm; Value: 43045-0212; MANUFACTURER #: 43045-0212; PART: 43045-0212; Part Description: Micro-Fit THT 2pos 3mm
Q1-Q4 = CSD18503Q5A: MOSFET N-CH 40V 100A 8VSON; MANUFACTURER: TI; VALUE: N-FET; MANUFACTURER #: CSD18503Q5A; PART: CSD18503Q5A; PART DESCRIPTION: MOSFET N-CH 40V 100A 8VSON; EE_SPEC: 40V 100A
R6-R9 = 10k 1% 0402: RES SMD 10K OHM 1% 1/16W 0402; MANUFACTURER: Yageo; MANUFACTURER #: RC0402FR-0710KP; PART DESCRIPTION: 10k Ohm ±1% 0.063W, 1/16W Chip Resistor 0402 (1005 Metric) Moisture Resistant Thick Film; VALUE: 10K; DISTRIBUTOR #: YAG1249TR-ND; DISTRIBUTOR: Digikey; PART: RC0402FR-0710KP; TOLERANCE: 1%; EE_SPEC: 1/16W
R20 R21 R25 R53 = RES 100R 0402 1%: RES SMD 100 OHM 1% 1/16W 0402; MANUFACTURER: Yageo; MANUFACTURER #: RC0402FR-07100RL; PART DESCRIPTION: 100 Ohm ±1% 0.063W, 1/16W Chip Resistor 0402 (1005 Metric) Moisture Resistant Thick Film; VALUE: 100R; DISTRIBUTOR #: 311-100LRTR-ND; DISTRIBUTOR: Digi-Key Electronics; PART: RC0402FR-07100RL; TOLERANCE: 1%; EE_SPEC: 1/16W
R24 R27 R52 R55 = RC0402FR-0710RL: RES SMD 10 OHM 1% 1/16W 0402; MANUFACTURER: Yageo; PART DESCRIPTION: 10 Ohm ±1% 0.063W, 1/16W Chip Resistor 0402 (1005 Metric) Moisture Resistant Thick Film; EE_SPEC: 10R 1% 0402; VALUE: 10R; MANUFACTURER #: RC0402FR-0710RL; DISTRIBUTOR #: 311-10.0LRTR-ND; DISTRIBUTOR: Digi-Key Electronics; PART: RC0402FR-0710RL; TOLERANCE: 1%
R29 R30 R39 R54 = RC0402FR-0710KP: RES SMD 10K OHM 1% 1/16W 0402; MANUFACTURER: Yageo; PART DESCRIPTION: 10k Ohm ±1% 0.063W, 1/16W Chip Resistor 0402 (1005 Metric) Moisture Resistant Thick Film; VALUE: 10K; MANUFACTURER #: RC0402FR-0710KP; DISTRIBUTOR #: YAG1249TR-ND; DISTRIBUTOR: Digi-Key Electronics; PART: RC0402FR-0710KP; TOLERANCE: 1%; EE_SPEC: 1/16W
TP35 TP37-TP40 TP58 TP59 TP62-TP66 = Socket: MANUFACTURER #: NOTAPART-Testpoint; PART: NOTAPART-Testpoint
U3-U5 U7 = ZXGD3009E6: MOSFET DRVR 3A 1-OUT High Speed Non-Inv6-Pin SOT-26 T/R; MANUFACTURER #: ZXGD3009E6TA; MANUFACTURER: Diodes Incorporated; PART DESCRIPTION: Low-Side Gate Driver IC Non-Inverting SOT-26; TOLERANCE: -NA-; EE_SPEC: 40V 2A; DISTRIBUTOR #: ZXGD3009E6TADITR-ND; DISTRIBUTOR: Digi-Key Electronics; PART: ZXGD3009E6TA; VALUE: ZXGD3009E6
U10 = SN74AHCT125: Quadruple Bus Buffer Gates With 3-State Outputs 14-VQFN -40 to 125; MANUFACTURER: Texas Instruments; PART DESCRIPTION: Buffer, Non-Inverting 4 Element 1 Bit per Element Push-Pull Output 14-VQFN (3.5x3.5); TOLERANCE: -NA-; VALUE: Tri-State Buffer; EE_SPEC: 5V 8mA; MANUFACTURER #: SN74AHCT125RGYR; DISTRIBUTOR #: 296-13910-2-ND; DISTRIBUTOR: Digi-Key Electronics; PART: SN74AHCT125RGYR

## Sheet Power.SchDoc: Power
size Letter; DocumentNumber: 4; SheetNumber: 4; SheetTotal: 11
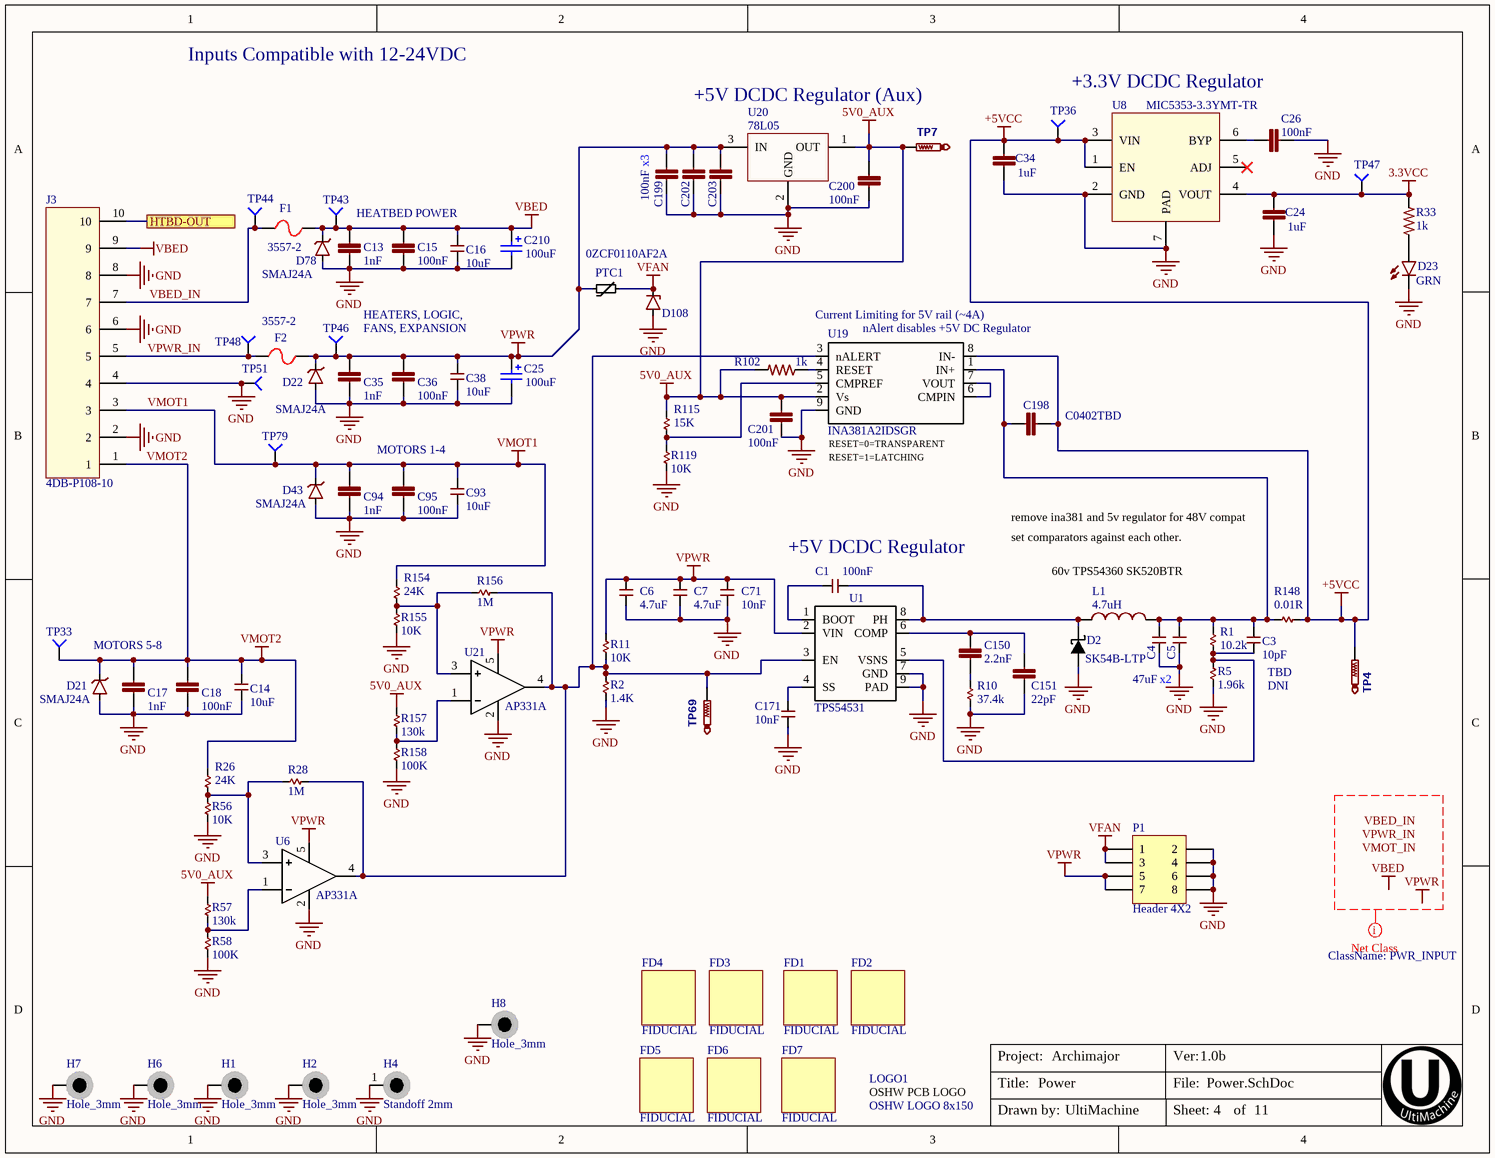
[diagram p3: Power.SchDoc]

### Parts
C1  100nF  [C0603]
C3  10pF  PART DESCRIPTION: TBD  [C0402]
C4  47uF  [C1210]
C5  47uF  [C1210]  (value not drawn)
C6  4.7uF  [C1210]
C7  4.7uF  [C1210]
C13  1nF  [C0402]
C14  10uF  [C1206]
C15  100nF  [C0603]
C16  10uF  [C1206]
C17  1nF  [C0402]
C18  100nF  [C0603]
C24  1uF  [C0402]
C25  value 100uF  [CAP-ELEC-063063077]  (hidden comment: UWT1V101MCL1GS)
C26  100nF  [C0402]
C34  1uF  [C0402]
C35  1nF  [C0402]
C36  100nF  [C0603]
C38  10uF  [C1206]
C71  10nF  [C0402]
C93  10uF  [C1206]
C94  1nF  [C0402]
C95  100nF  [C0603]
C150  2.2nF  [C0402]
C151  22pF  [C0402]
C171  10nF  [C0402]
C198  C0402TBD  [C0402]
C199  100nF  [C0603]
C200  100nF  [C0402]
C201  100nF  [C0402]
C202  100nF  [C0603]  (value not drawn)
C203  100nF  [C0603]  (value not drawn)
C210  value 100uF  [CAP-ELEC-063063077]  (hidden comment: UWT1V101MCL1GS)
D2  SK54B-LTP  [SMB_DO-214AA_LRG]
D21  SMAJ24A  [SMA-SM]
D22  SMAJ24A  [SMA-SM]
D23  GRN  [LED2012120]
D43  SMAJ24A  [SMA-SM]
D78  SMAJ24A  [SMA-SM]
D108  TVS 30V SMF  [SMF]  (value not drawn)
F1  3557-2  [3557]
F2  3557-2  [3557]
FD1  FIDUCIAL  [FIDUCIAL-1X2]
FD2  FIDUCIAL  [FIDUCIAL-1X2]
FD3  FIDUCIAL  [FIDUCIAL-1X2]
FD4  FIDUCIAL  [FIDUCIAL-1X2]
FD5  FIDUCIAL  [FIDUCIAL-1X2]
FD6  FIDUCIAL  [FIDUCIAL-1X2]
FD7  FIDUCIAL  [FIDUCIAL-1X2]
H1  Hole_3mm  [HOLE 3mm]  (no BOM)
H2  Hole_3mm  [HOLE 3mm]  (no BOM)
H4  Standoff 2mm  [Standoff SMT-M2 5mm Tall]
H6  Hole_3mm  [HOLE 3mm]  (no BOM)
H7  Hole_3mm  [HOLE 3mm]  (no BOM)
H8  Hole_3mm  [HOLE 3mm]  (no BOM)
J3  4DB-P108-10  [CON-Barrier-10-8.26mm]
L1  4.7uH  [IND_10X10]
LOGO1  OSHW LOGO 8x150  [OSHW_8X150_NOTEXT]  (no BOM)
P1  Header 4X2  [HDR2X4]
PTC1  0ZCF0110AF2A  [PTC_0ZCF]
R1  10.2k  [R0402]
R2  1.4K  [R0402]
R5  1.96k  [R0402]
R10  37.4k  [R0402]
R11  10K  [R0402]
R26  24K  [R0402]
R28  1M  [R0402]
R33  1k  [R0402]
R56  10K  [R0402]
R57  130k  [R0402]
R58  100K  [R0402]
R102  1k  [R0402]
R115  15K  [R0402]
R119  10K  [R0402]
R148  0.01R  [R0805]
R154  24K  [R0402]
R155  10K  [R0402]
R156  1M  [R0402]
R157  130k  [R0402]
R158  100K  [R0402]
TP4  TestPoint  [TP1-27]  (value not drawn)  (no BOM)
TP7  TestPoint  [TP1-27]  (value not drawn)  (no BOM)
TP33  TP4  [TP-2]  (value not drawn)  (no BOM)
TP36  TP4  [TP-2]  (value not drawn)  (no BOM)
TP43  TP4  [TP-2]  (value not drawn)  (no BOM)
TP44  TP4  [TP-2]  (value not drawn)  (no BOM)
TP46  TP4  [TP-2]  (value not drawn)  (no BOM)
TP47  TP4  [TP-2]  (value not drawn)  (no BOM)
TP48  TP4  [TP-2]  (value not drawn)  (no BOM)
TP51  TP4  [TP-2]  (value not drawn)  (no BOM)
TP69  TestPoint  [TP1-27]  (value not drawn)  (no BOM)
TP79  TP4  [TP-2]  (value not drawn)  (no BOM)
U1  TPS54531  [SOIC127P600X170_HS-9L]
U6  AP331A  [SOT23-5]
U8  MIC5353-3.3YMT-TR  [TDFN1616-6LD-PL-1]
U19  INA381A2IDSGR  [WSON8_2x2mm]
U20  78L05  [SOT-89-3]
U21  AP331A  [SOT23-5]

### Ports
HTBD-OUT

### Nets
3.3VCC: C24.1 R33.2 TP47.1 U8.4(VOUT)
5V0_AUX: C200.2 C201.2 R57.2 R102.2 R115.2 R157.2 TP7.TP U19.2(Vs) U20.1(OUT)
+5VCC: C34.1 C198.1 R148.2 TP4.TP TP36.1 U8.1(EN) U8.3(VIN) U19.8(IN-)
GND: C4.1 C5.1 C6.1 C7.1 C13.2 C14.1 C15.2 C16.1 C17.2 C18.2 C24.2 C25.2 C26.2 C34.2 C35.2 C36.2 C38.1 C71.1 C93.1 C94.2 C95.2 C151.1 C171.1 C199.2 C200.1 C201.1 C202.2 C203.2 C210.2 D2.A(ANODE) D21.A D22.A D23.C D43.A D78.A D108.A H1.?1 H2.?1 H4.1 H6.?1 H7.?1 H8.?1 J3.2 J3.4 J3.6 J3.8 P1.2 P1.4 P1.6 P1.8 R2.1 R5.1 R10.1 R56.1 R58.1 R119.1 R155.1 R158.1 TP51.1 U1.7(GND) U1.9(PAD) U6.2(GND) U8.2(GND) U8.7(PAD) U19.9(GND) U20.2(GND) U21.2(GND)
VBED: C13.1 C15.1 C16.2 C210.1 D78.K F1.2 J3.9 TP43.1
VFAN: D108.K P1.1 P1.3 PTC1.2
VMOT1: C93.2 C94.1 C95.1 D43.K J3.3 R154.1 TP79.1  [project net VMOT]
VMOT2: C14.2 C17.1 C18.1 D21.K J3.1 R26.1 TP33.1  [project net VMOT]
VPWR: C6.2 C7.2 C25.1 C35.1 C36.1 C38.2 C71.2 C199.1 C202.1 C203.1 D22.K F2.2 P1.5 P1.7 PTC1.1 R11.2 TP46.1 U1.2(VIN) U6.5(VCC) U20.3(IN) U21.5(VCC)
HTBD-OUT: J3.10 ; port HTBD-OUT
VBED_IN: F1.1 J3.7 TP44.1
VPWR_IN: F2.1 J3.5 TP48.1
NetC1_1: C1.1 U1.1(BOOT)
NetC1_2: C1.2 D2.K(CATHODE) L1.1 U1.8(PH)
NetC3_1: C3.1 R1.2 R5.2 U1.5(VSNS)
NetC3_2: C3.2 C4.2 C5.2 C198.2 L1.2 R1.1 R148.1 U19.1(IN+)
NetC26_1: C26.1 U8.6(BYP)
NetC150_1: C150.1 R10.2
NetC150_2: C150.2 C151.2 U1.6(COMP)
NetC171_2: C171.2 U1.4(SS)
NetD23_A: D23.A R33.1
NetR2_2: R2.2 R11.1 R28.1 R156.1 TP69.TP U1.3(EN) U6.4(OUT) U19.3(nALERT) U21.4(OUT)
NetR26_2: R26.2 R28.2 R56.2 U6.3(IN+)
NetR57_1: R57.1 R58.2 U6.1(IN-)
NetR102_1: R102.1 U19.4(RESET)
NetR115_1: R115.1 R119.2 U19.5(CMPREF)
NetR154_2: R154.2 R155.2 R156.2 U21.3(IN+)
NetR157_1: R157.1 R158.2 U21.1(IN-)
NetU19_6: U19.6(CMPIN) U19.7(VOUT)

Not connected (* = marked no-connect by the designer): U8 5(ADJ)*

### Layout directives
net class PWR_INPUT: VBED, VBED_IN, VMOT_IN, VPWR, VPWR_IN

### Notes on the sheet
- Inputs Compatible with 12-24VDC
- +5V DCDC Regulator (Aux)
- +3.3V DCDC Regulator
- (near C199) x3
- HEATBED POWER
- FANS, EXPANSION
- HEATERS, LOGIC,
- Current Limiting for 5V rail (~4A)
- (near U19) nAlert disables +5V DC Regulator
- MOTORS 1-4
- RESET=1=LATCHING
- (near U19) RESET=0=TRANSPARENT
- (near C1) +5V DCDC Regulator
- remove ina381 and 5v regulator for 48V compat
- set comparators against each other.
- 60v TPS54360 SK520BTR
- MOTORS 5-8
- x2
- Labels drawn without touching a wire or pin: VBED, VBED_IN, VMOT_IN, VPWR, VPWR_IN
- Title:
- Project:
- File:
- Ver:
- Drawn by:
- Sheet:
- of
- (in symbol OSHW LOGO 8x150) OSHW PCB LOGO

### Library data of the parts
C1 = 100nF 0603 50V X7R: CAP CER 0603 100nF 50V 10% X7R; MANUFACTURER: Kemet; MANUFACTURER #: C0603C104K5RACTU; PART DESCRIPTION: 0.1µF ±10% 50V Ceramic Capacitor X7R 0603 (1608 Metric); TOLERANCE: +/- 10%; EE_SPEC: 100nF 50V X7R 0603; DISTRIBUTOR #: 399-5089-2-ND; DISTRIBUTOR: Digi-Key; PART: C0603C104K5RACTU; VALUE: 100nF
C3 = C0402_TBD: CAP CER 0402 TBD; EE_SPEC: 50V; MANUFACTURER #: TBD; MANUFACTURER: TBD; DISTRIBUTOR #: TBD; PART: TBD; DNI: DNI; VALUE: 10pF
C4 C5 = 47uF 1210 10V X5R: CAP CER 47UF 10V X5R 1210; MANUFACTURER: Murata; MANUFACTURER #: GRM32ER61A476KE20L; PART DESCRIPTION: 47µF ±10% 10V Ceramic Capacitor X5R 1210 (3225 Metric); TOLERANCE: 10%; EE_SPEC: 10V, 3mOhm; DISTRIBUTOR #: 490-3887-1-ND; DISTRIBUTOR: Digikey; PART: GRM32ER61A476KE20L; VALUE: 47uF
C6 C7 = 4.7uF 1210 50V X7R: CAP CER 4.7UF 50V X7R 1210; MANUFACTURER: Murata; MANUFACTURER #: GRM32ER71H475KA88L; PART DESCRIPTION: 4.7µF ±10% 50V Ceramic Capacitor X7R 1210 (3225 Metric); TOLERANCE: 10%; DISTRIBUTOR #: 490-1864-1-ND; DISTRIBUTOR: Digikey; PART: GRM32ER71H475KA88L; EE_SPEC: 50V; VALUE: 4.7uF
C13 C17 C35 C94 = CAP 1nF 50V 0402 X7R: 1000pF 50V Ceramic Capacitor X7R 0402 (1005 Metric) 0.039" L x 0.020" W (1.00mm x 0.50mm); MANUFACTURER: Murata; MANUFACTURER #: GRM155R71H102KA01D; PART DESCRIPTION: 1000pF ±10% 50V Ceramic Capacitor X7R 0402 (1005 Metric); TOLERANCE: 10%; VALUE: 1nF; DISTRIBUTOR #: 490-1303-2-ND; DISTRIBUTOR: Digi-Key Electronics; PART: GRM155R71H102KA01D; EE_SPEC: 50V
C14 C16 C38 C93 = 10uF 1206 50V X5R: CAP CER 10UF 50V 10% X5R 1206; MANUFACTURER: Taiyo Yuden; MANUFACTURER #: UMK316BBJ106ML-T; PART: CAP CER 10UF 50V X5R 1206; PART DESCRIPTION: 10µF ±20% 50V Ceramic Capacitor X5R 1206 (3216 Metric); TOLERANCE: 10%; EE_SPEC: 50V; MANUFACTURER2#: UMK316BBJ106ML-T; VALUE: 10uF
C15 C18 C36 C95 = C0603C104K5RACTU: CAP CER 0603 100nF 50V 10% X7R; MANUFACTURER: Kemet; PART DESCRIPTION: 0.10µF ±10% 50V Ceramic Capacitor X7R 0603 (1608 Metric); EE_SPEC: 100nF 50V X7R 0603; VALUE: 100nF; MANUFACTURER #: C0603C104K5RACTU; DISTRIBUTOR #: 399-5089-2-ND; DISTRIBUTOR: Digi-Key Electronics; PART: C0603C104K5RACTU; TOLERANCE: 10%
C24 C34 = GRM155R60J105KE19D: CAP CER 0402 1uF 6.3V 10% X5R; MANUFACTURER: Murata; PART DESCRIPTION: 1µF ±10% 6.3V Ceramic Capacitor X5R 0402 (1005 Metric); EE_SPEC: 1uF 6.3V X5R 0402; VALUE: 1uF; MANUFACTURER #: GRM155R60J105KE19D; DISTRIBUTOR #: 490-1320-2-ND; DISTRIBUTOR: Digi-Key Electronics; PART: GRM155R60J105KE19D; TOLERANCE: 10%
C25 C210 = UWT1V101MCL1GS: CAP ALUM 100UF 35V 20% SMD; MANUFACTURER: Nichicon; PART DESCRIPTION: 100µF 35V Aluminum Capacitors Radial, Can - SMD 1000 Hrs @ 105°C; EE_SPEC: 100uF 35V Al-El; MANUFACTURER #: UWT1V101MCL1GS; DISTRIBUTOR #: 493-2203-2-ND; DISTRIBUTOR: Digi-Key Electronics; PART: UWT1V101MCL1GS; TOLERANCE: 20%
C26 C200 C201 = GRM155R71C104KA88D: as C19 on sheet Mosfets; VALUE: 100nF; MANUFACTURER #: GRM155R71C104KA88D; DISTRIBUTOR #: 490-3261-2-ND; DISTRIBUTOR: Digi-Key Electronics; PART: GRM155R71C104KA88D; TOLERANCE: 10%
C71 C171 = 10nF 0402 50V X7R: CAP CER 10nF 50V X7R 0402; PART DESCRIPTION: 10000pF ±5% 50V Ceramic Capacitor X7R 0402 (1005 Metric); MANUFACTURER #: GRM155R71H103JA88D; MANUFACTURER: Murata; TOLERANCE: 5%; EE_SPEC: 50V; DISTRIBUTOR #: 490-7763-1-ND; DISTRIBUTOR: Digikey; PART: GRM155R71H103JA88D; VALUE: 10nF
C150 = 2.2nF 25V C0G 0402: CAP CER 0402 2.2nF 25V C0G; MANUFACTURER: Kemet; MANUFACTURER #: C0402C222J3GACTU; PART DESCRIPTION: 2200pF ±5% 25V Ceramic Capacitor C0G, NP0 0402 (1005 Metric); EE_SPEC: 25; TOLERANCE: 5%; VALUE: 2.2nF; DISTRIBUTOR #: 399-8957-2-ND; DISTRIBUTOR: Digikey; PART: C0402C222J3GACTU
C151 = 22pF 0402 50V C0G: CAP CER 0402 22pF 50V 5% C0G; Manufacturer: AVX; MANUFACTURER #: 04025A220JAT2A; Part Description: 22pF ±5% 50V Ceramic Capacitor C0G, NP0 0402 (1005 Metric); EE_SPEC: 22pF 5% 50V NP0 0402; VALUE: 22pF; DISTRIBUTOR #: 478-1074-2-ND; DISTRIBUTOR: Digi-Key; PART: 04025A220JAT2A; Tolerance: 5%
C198 = C0402TBD: Capacitor Non Polarized; MANUFACTURER #: DNI-C0402TBD; VALUE: C0402TBD; PART: DNI-C0402TBD; DNI: DNI
C199 C202 C203 = C0603C104K5RACTU: CAP CER 0603 100nF 50V 10% X7R; Manufacturer: Kemet; Part Description: 0.1µF ±10% 50V Ceramic Capacitor X7R 0603 (1608 Metric); EE_SPEC: 100nF 50V X7R 0603; VALUE: 100nF; MANUFACTURER #: C0603C104K5RACTU; DISTRIBUTOR #: 399-5089-2-ND; DISTRIBUTOR: Digi-Key Electronics; PART: C0603C104K5RACTU; Tolerance: 10%
D2 = SK54B: DIODE SCHOTTKY 40V 5A SMB_DO214AA; MANUFACTURER: MCC; VOLTAGE: 40Vrb; PART: SK54B-LTP; MANUFACTURER #: SK54B-LTP; DISTRIBUTOR: DIGI-KEY; DISTRIBUTOR #: SK54B-LTPMSTR-ND
D21 D22 D43 D78 = SMAJ24A: as D46 on sheet Motors; MANUFACTURER #: SMAJ24A; DISTRIBUTOR #: SMAJ24ABTR-ND; DISTRIBUTOR: Digi-Key; Part Description: TVS DIODE 24V 38.9V SMA; VALUE: SMAJ24A; PART: SMAJ24A
D23 = 5988170107F: LED 0805 Green; MANUFACTURER: Dialight; PART DESCRIPTION: Green 566nm LED Indication - Discrete 2V 0805 (2012 Metric); TOLERANCE: -NA-; EE_SPEC: Vf=2V; VALUE: GRN; MANUFACTURER #: 5988170107F; DISTRIBUTOR #: 350-2044-2-ND; DISTRIBUTOR: Digi-Key Electronics; PART: 5988170107F
D108 = TVS 30V SMF: TVS DIODE 30VWM 48.4VC SMF; MANUFACTURER: Vishay; MANUFACTURER #: SMF30A-E3-08; PART: TVS Diode 48.4VC; TOLERANCE: -NA-; EE_SPEC: 30Vrs 48.4Vc; VALUE: -NA-; DISTRIBUTOR #: SMF30A-E3-08GITR-ND; DISTRIBUTOR: Digikey; PART DESCRIPTION: TVS DIODE 30VWM 48.4VC SMF
F1 F2 = 3557-2: FUSE PTH ATO; MANUFACTURER: Keystone; PART DESCRIPTION: Fuse Block 30A 500V 1 Circuit Blade PCB; TOLERANCE: -NA-; VALUE: -NA-; EE_SPEC: 500V; MANUFACTURER #: 3557-2; DISTRIBUTOR #: 36-3557-2-ND; DISTRIBUTOR: Digi-Key Electronics; PART: 3557-2
FD1-FD7 = FIDUCIAL: MANUFACTURER #: NOTAPART-Fiducial; PART: NOTAPART-Fiducial
H1 H2 H6-H8 = Hole_3mm: MANUFACTURER #: NOTAPART-Hole
H4 = Standoff SMT M2 5mm Tall: Round Standoff Threaded M2x0.4 Steel 0.197" (5.00mm); MANUFACTURER #: 9774050243R; MANUFACTURER: Würth Elektronik; PART DESCRIPTION: Round Standoff Threaded M2x0.4 Steel 0.197" (5.00mm)
J3 = 10 Pos barrier: CONN BARRIER STRIP 10CIRC 0.325"; Manufacturer: TE; Part Description: 10 Circuit 0.325" (8.26mm) Barrier Block Connector, Screws with Captive Plate; Tolerance: NA; DISTRIBUTOR: Digi-Key; MANUFACTURER #: 4DB-P108-10; PART: 4DB-P108-10; VALUE: 4DB-P108-10
L1 = 4.7uH 10A: FIXED IND 4.7UH 10A 15.5 MOHM; Manufacturer: Bourns; MANUFACTURER #: SRP1038A-4R7M; Part Description: 4.7µH Shielded Wirewound Inductor 10A 15.5 mOhm Max Nonstandard; EE_SPEC: Irms=10A, Isat=17A, DCR=0.016Ohms; Tolerance: +/- 20%; Value: 4.7uH; DISTRIBUTOR #: SRP1038A-4R7MTR-ND; DISTRIBUTOR: Digi-Key; PART: SRP1038A-4R7M
LOGO1 = OSHW LOGO 8x150: MANUFACTURER #: NOTAPART-OSHW LOGO; PART: NOTAPART-OSHW LOGO
P1 = Header 4X2: Header, 4-Pin, Dual row; MANUFACTURER #: 2213S-08G; MANUFACTURER: Multicomp; PART DESCRIPTION: Board-To-Board Connector, 2.54 mm, 8 Contacts, Header, 2213S Series, Through Hole, 2 Rows; TOLERANCE: -NA-; VALUE: HDR8; DISTRIBUTOR #: 08N6790; DISTRIBUTOR: Future; PART: 2213S-08G; EE_SPEC: -NA-
PTC1 = PTC RESET FUSE 60V 1.1A 2920: MANUFACTURER: Bel Fuse Inc.; PART DESCRIPTION: Polymeric PTC Resettable Fuse 60V 1.1 A Ih Surface Mount 2920 (7351 Metric), Concave; MANUFACTURER #: 0ZCF0110AF2A; PART: 0ZCF0110AF2A
R1 = 10.2k 1% 0402: RES SMD 10.2K OHM 1% 1/16W 0402; MANUFACTURER: Yageo; MANUFACTURER #: RC0402FR-0710K2L; PART DESCRIPTION: 10.2 kOhms ±1% 0.063W, 1/16W Chip Resistor 0402 (1005 Metric) Moisture Resistant Thick Film; DISTRIBUTOR #: YAG2950TR-ND; DISTRIBUTOR: Digikey; PART: RC0402FR-0710K2L; TOLERANCE: 1%; EE_SPEC: 1/16W; VALUE: 10.2k
R2 = 1.4k 1% 0402: RES SMD 1.4K OHM 1% 1/16W 0402; MANUFACTURER: Stackpole; MANUFACTURER #: RMCF0402FT1K40; Part Description: 1.4 kOhms ±1% 0.063W, 1/16W Chip Resistor 0402 (1005 Metric) Automotive AEC-Q200 Thick Film; Tolerance: +/- 1%; EE_SPEC: 1.4k 1% 0402; VALUE: 1.4K; PART: RMCF0402FT1K40
R5 = 1.96k 1% 0402: RES SMD 1.96K OHM 1% 1/16W 0402; MANUFACTURER: Yageo; MANUFACTURER #: RC0402FR-071K96L; PART DESCRIPTION: 1.96 kOhms ±1% 0.063W, 1/16W Chip Resistor 0402 (1005 Metric) Moisture Resistant Thick Film; VALUE: 1.96k; DISTRIBUTOR #: 311-1.96KLRTR-ND; DISTRIBUTOR: Digikey; EE_SPEC: 1/16W; PART: RC0402FR-071K96L; TOLERANCE: 1%
R10 = 37.4K 1% 0402: RES SMD 37.4K OHM 1% 1/16W 0402; MANUFACTURER: Yageo; MANUFACTURER #: RC0402FR-0737K4L; PART DESCRIPTION: 37.4 kOhms ±1% 0.063W, 1/16W Chip Resistor 0402 (1005 Metric) Moisture Resistant Thick Film; DISTRIBUTOR #: YAG3138CT-ND; DISTRIBUTOR: Digikey; PART: RC0402FR-0737K4L; TOLERANCE: 1%; EE_SPEC: 1/16W; VALUE: 37.4k
R11 R56 R119 R155 = 10k 1% 0402: as R6 on sheet Mosfets; DISTRIBUTOR #: YAG1249TR-ND; DISTRIBUTOR: Digikey; PART: RC0402FR-0710KP; TOLERANCE: 1%; EE_SPEC: 1/16W; VALUE: 10K
R26 R154 = 24k 1% 0402: RES SMD 24K OHM 1% 1/16W 0402; MANUFACTURER: Visha Dale; MANUFACTURER #: CRCW040224K0FKEDC; Part Description: 24 kOhms ±1% 0.063W, 1/16W Chip Resistor 0402 (1005 Metric)  Thick Film; Tolerance: +/- 1%; EE_SPEC: 24k 1% 0402; VALUE: 24K; PART: CRCW040224K0FKEDC
R28 R156 = 1M 5% 0402: RES 0402 1M 100mW 5%; MANUFACTURER: Panasonic; MANUFACTURER #: ERJ2GEJ105X; PART DESCRIPTION: 1M Ohm ±5% 0.1W, 1/10W Chip Resistor 0402 (1005 Metric) Automotive AEC-Q200 Thick Film; EE_SPEC: 1/10W; DISTRIBUTOR #: P1.0MJTR-ND; DISTRIBUTOR: Digikey; PART: ERJ2GEJ105X; TOLERANCE: 5%; VALUE: 1M
R33 R102 = RK73H1ETTP1001F: RES 0402 1k 63mW 1%; MANUFACTURER: Yageo; MANUFACTURER #: RC0402FR-071KL; PART DESCRIPTION: 1k Ohm ±1% 0.063W, 1/16W Chip Resistor 0402 (1005 Metric) Moisture Resistant Thick Film; EE_SPEC: 1/16W; VALUE: 1k; DISTRIBUTOR #: 311-1.00KLRTR-ND; DISTRIBUTOR: Digi-Key Electronics; PART: RC0402FR-071KL; TOLERANCE: 1%
R57 R157 = 130k 1% 0402: RES SMD 130K OHM 5% 1/16W 0402; MANUFACTURER: Yageo; MANUFACTURER #: RC0402JR-07130KL; PART DESCRIPTION: 130 kOhms ±5% 0.063W, 1/16W Chip Resistor 0402 (1005 Metric) Moisture Resistant Thick Film; TOLERANCE: 1%; DISTRIBUTOR #: YAG3273CT-ND; DISTRIBUTOR: Digikey; PART: RC0402JR-07130KL; EE_SPEC: 1/16W; VALUE: 130k
R58 R158 = 100k 1% 0402: RES SMD 100K OHM 1% 1/16W 0402; MANUFACTURER: Samsung; MANUFACTURER #: RC1005F104CS; PART DESCRIPTION: 100k Ohm ±1% 0.063W, 1/16W Chip Resistor 0402 (1005 Metric) Moisture Resistant Thick Film; DISTRIBUTOR #: 1276-3432-1-ND; DISTRIBUTOR: Digikey; PART: RC1005F104CS; TOLERANCE: 1%; EE_SPEC: 1/16W; VALUE: 100K
R115 = 15K 1% 0402: RES SMD 15K 1% 1/16W 0402; MANUFACTURER: Samsung; MANUFACTURER #: RC1005F153CS; PART DESCRIPTION: 15K Ohm ±1% 0.063W, 1/16W Chip Resistor 0402 (1005 Metric) Moisture Resistant Thick Film; DISTRIBUTOR #: 1276-3442-2-ND; DISTRIBUTOR: Digikey; PART: RC1005F153CS; TOLERANCE: 1%; EE_SPEC: 1/16W; VALUE: 15K
R148 = 0.01R 1% 0805: RES 0.01 OHM 1% 1/2W 0805; MANUFACTURER: Susumu; MANUFACTURER #: KRL1220E-M-R010-F-T5; PART DESCRIPTION: 10 mOhms ±1% 0.5W, 1/2W Chip Resistor 0805 (2012 Metric) Automotive AEC-Q200, Current Sense Metal Foil; EE_SPEC: 0.5W; DISTRIBUTOR #: 408-1544-2-ND; DISTRIBUTOR: Digikey; PART: KRL1220E-M-R010-F-T5; TOLERANCE: 1%; VALUE: 0.01R
TP4 TP7 TP69 = TestPoint: Test Point
TP33 TP36 TP43 TP44 TP46-TP48 TP51 TP79 = Socket: MANUFACTURER #: NOTAPART-Testpoint; PART: NOTAPART-Testpoint
U1 = TPS54531: IC REG BUCK ADJ 5A 8SOPWRPAD; MANUFACTURER #: TPS54531DDAR; MANUFACTURER: TI; PART DESCRIPTION: Buck Switching Regulator IC Positive Adjustable 0.8V 1 Output 5A 8-PowerSOIC (0.154", 3.90mm Width); EE_SPEC: 28Vin_max, 5A, 570kHz; VALUE: TPS54531; DISTRIBUTOR #: 296-40801-2-ND; DISTRIBUTOR: Digikey; PART: TPS54531DDAR
U6 U21 = AP331A: IC QUAD DIFF COMPARATOR 14 -SOIC; PART: AP331AWG-7; MANUFACTURER: TEXAS INSTRUMENTS; MANUFACTURER #: AP331AWG-7; DISTRIBUTOR: DIGI-KEY; DISTRIBUTOR #: AP331AWGDITR-ND; VALUE: AP331A
U8 = MIC5353-3.3YMT-TR: LDO 3.3V 500mA - low ESR Cout; MANUFACTURER: Microchip; PART DESCRIPTION: Linear Voltage Regulator IC Positive Fixed 1 Output 3.3V 500mA 6-TMLF® (1.6x1.6); TOLERANCE: -NA-; VALUE: 3.3V LDO; MANUFACTURER #: MIC5353-3.3YMT-TR; DISTRIBUTOR #: 576-3680-2-ND; DISTRIBUTOR: Digi-Key Electronics; PART: MIC5353-3.3YMT-TR; EE_SPEC: 500mA
U19 = INA381_ALT: IC COMPARATOR BIDIR 8WSON; MANUFACTURER: TI; TOLERANCE: -NA-; EE_SPEC: Vcc 2.7-5.5V; Vcm 26V; MANUFACTURER #: INA381A2IDSGR; DISTRIBUTOR #: 296-49078-2-ND; DISTRIBUTOR: Digikey; PART: INA381A2IDSGR; VALUE: INA381A2
U20 = 78L05: IC REG LINEAR 5V 100MA SOT89-3; MANUFACTURER #: L78L05ABUTR; MANUFACTURER: ST; PART DESCRIPTION: Linear Voltage Regulator IC Positive Fixed 1 Output 5V 100mA SOT-89-3; TOLERANCE: -NA-; VALUE: 5V LDO; EE_SPEC: Vin 30V, Iout 0.1A; DISTRIBUTOR #: 497-1181-2-ND; DISTRIBUTOR: Digikey; PART: L78L05ABUTR